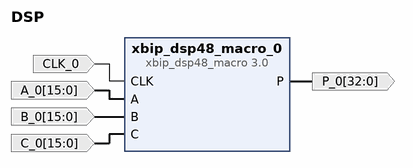
[diagram p0: block diagram of the top level]
# Vivado block design DSP, xc7a100tcsg324-1, Vivado 2018.3
create_bd_design DSP

create_bd_port -dir O -from 32 -to 0 -type data P_0
create_bd_port -dir I -type clk CLK_0
create_bd_port -dir I -from 15 -to 0 -type data A_0
create_bd_port -dir I -from 15 -to 0 -type data B_0
create_bd_port -dir I -from 15 -to 0 -type data C_0

create_bd_cell -type ip -vlnv xilinx.com:ip:xbip_dsp48_macro:3.0 xbip_dsp48_macro_0
set_property -dict [list \
  CONFIG.a_width 16 \
  CONFIG.b_width 16 \
  CONFIG.c_width 16 \
  CONFIG.p_binarywidth 0 \
  CONFIG.p_full_width 33 \
  CONFIG.p_width 33 \
] [get_bd_cells xbip_dsp48_macro_0]

# ---- connections ----

connect_bd_net [get_bd_pins xbip_dsp48_macro_0/P] [get_bd_ports P_0]
connect_bd_net -net CLK_0_1 [get_bd_ports CLK_0] [get_bd_pins xbip_dsp48_macro_0/CLK]
connect_bd_net -net A_0_1 [get_bd_ports A_0] [get_bd_pins xbip_dsp48_macro_0/A]
connect_bd_net -net B_0_1 [get_bd_ports B_0] [get_bd_pins xbip_dsp48_macro_0/B]
connect_bd_net -net C_0_1 [get_bd_ports C_0] [get_bd_pins xbip_dsp48_macro_0/C]

validate_bd_design
save_bd_design
